# EAGLE design clogic (EAGLE 5.10)

## Sheet 1 of 2
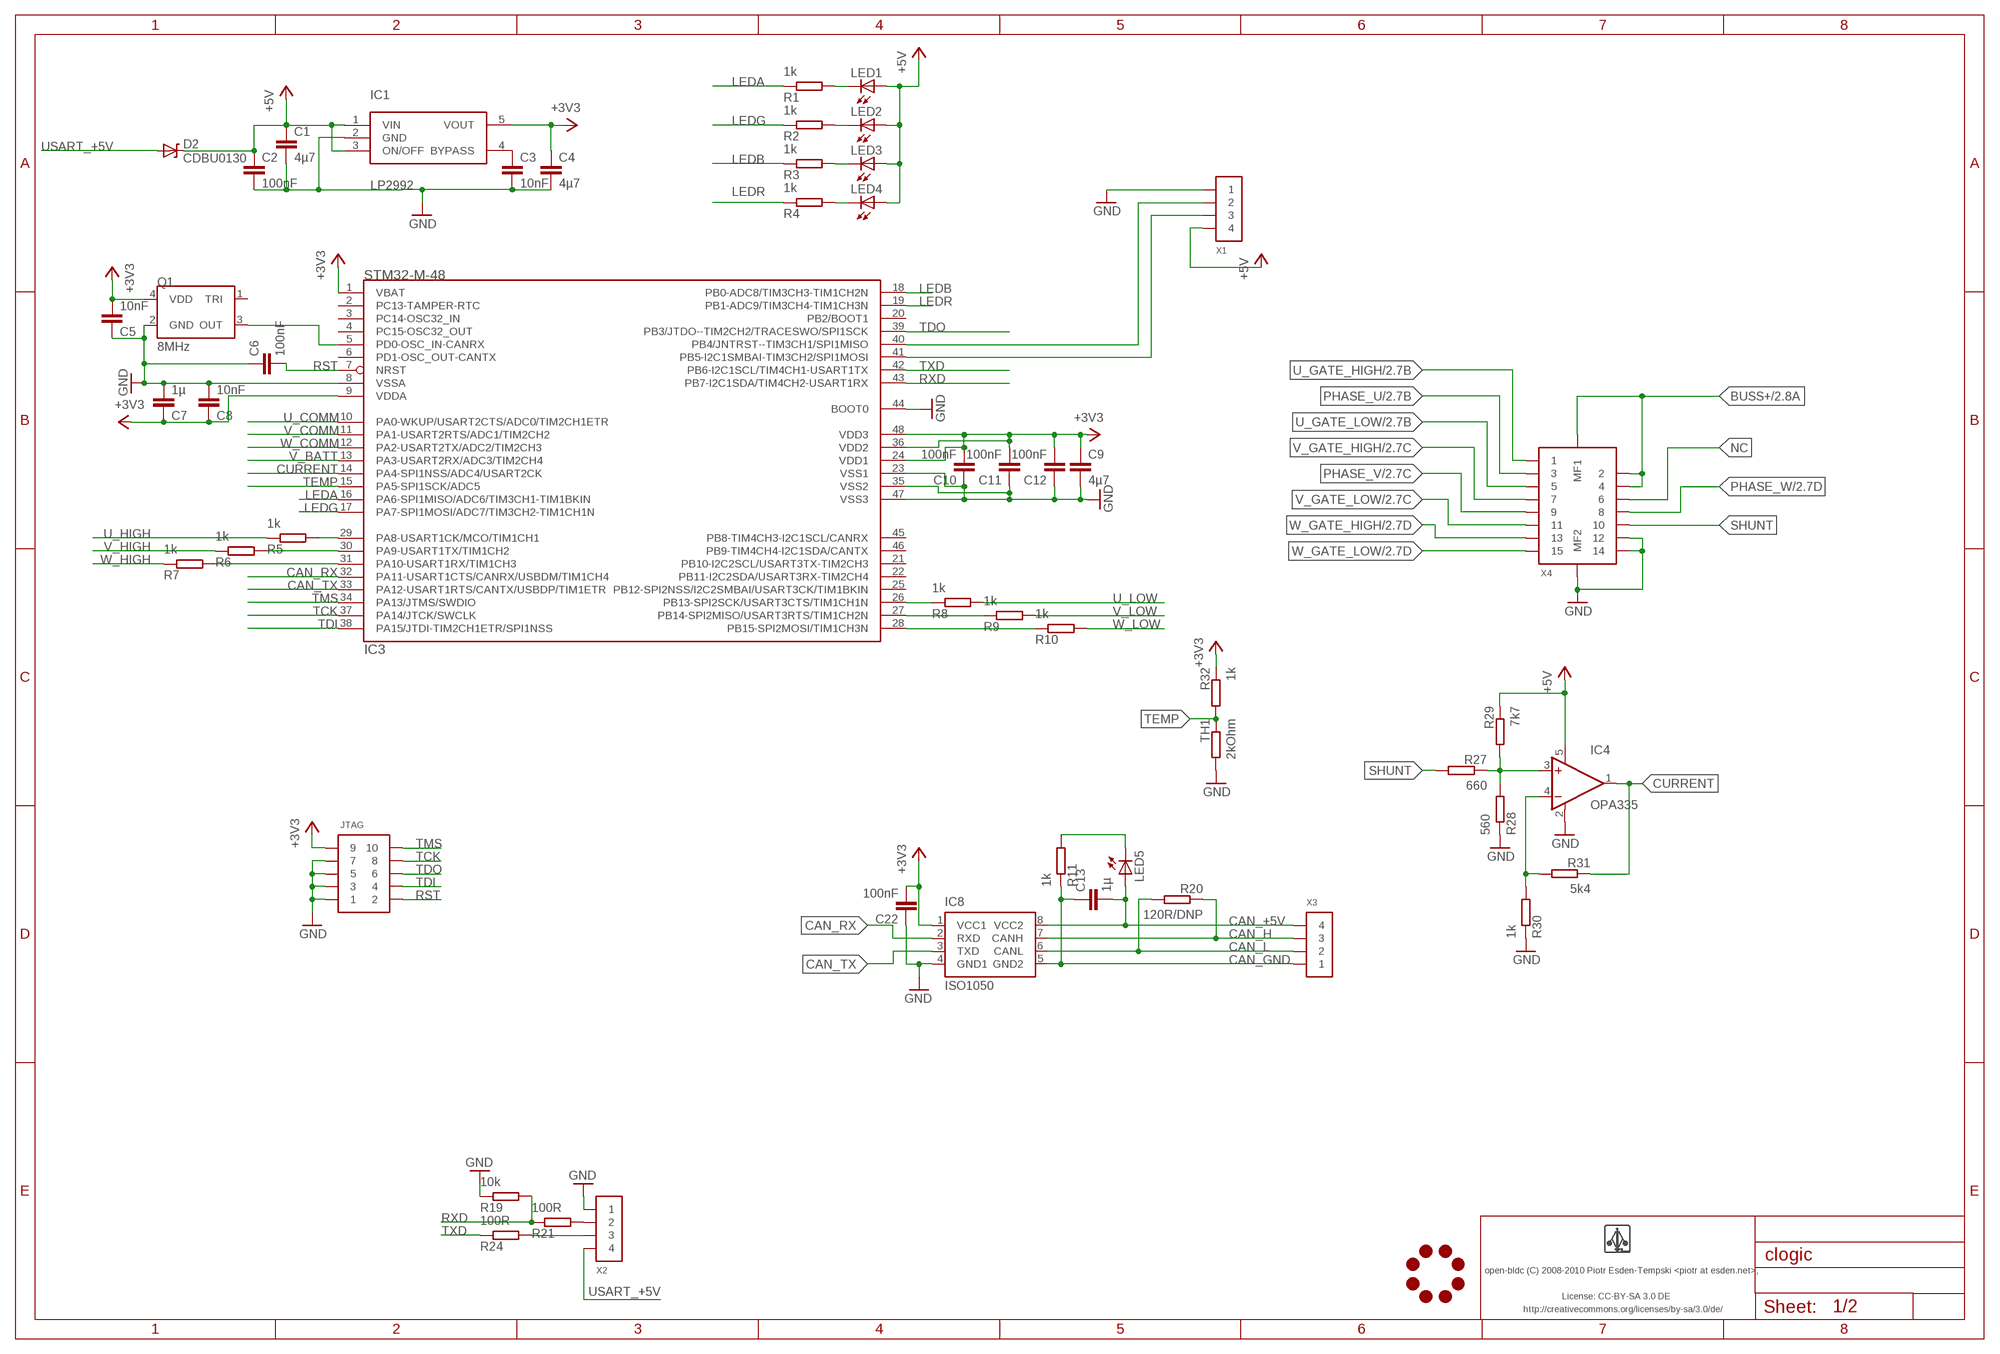
[diagram p0: schematic, sheet 1]

### Parts
C1  4µ7  CAPACITOR-0603  [0603-CAP]
C2  100nF  CAPACITOR-0603  [0603-CAP]
C3  10nF  CAPACITOR-0603  [0603-CAP]
C4  4µ7  CAPACITOR-0603  [0603-CAP]
C5  10nF  CAPACITOR-0603  [0603-CAP]
C6  100nF  CAPACITOR-0603  [0603-CAP]
C7  1µ  CAPACITOR-0603  [0603-CAP]
C8  10nF  CAPACITOR-0603  [0603-CAP]
C9  4µ7  CAPACITOR-0603  [0603-CAP]
C10  100nF  CAPACITOR-0603  [0603-CAP]
C11  100nF  CAPACITOR-0603  [0603-CAP]
C12  100nF  CAPACITOR-0603  [0603-CAP]
C13  1µ  CAPACITOR-0603  [0603-CAP]
C22  100nF  CAPACITOR-0603  [0603-CAP]
D2  CDBU0130  DIODE-ZENER-0603  [0603-LED]
IC1  LP2992  [SOT23-5]
IC3  STM32-M-48  [LQFP48]
IC4  OPA335  [SOT23-5]
IC8  ISO1050  [SO8]
JL1  JOBY_LOGO-6MIL  [JOBY_LOGO_6MIL]
JTAG  CONN_5-2-FTSH-V  [FTSH-105-DV]
LED1  AMBER  LED-0603  [0603-LED]
LED2  GREEN  LED-0603  [0603-LED]
LED3  BLUE  LED-0603  [0603-LED]
LED4  RED  LED-0603  [0603-LED]
LED5  WHITE  LED-0603  [0603-LED]
Q1  8MHz  ASE_ASCILLATOR  [ASE_OSCILLATOR]
R1  1k  RESISTOR-0603  [0603-RES]
R2  1k  RESISTOR-0603  [0603-RES]
R3  1k  RESISTOR-0603  [0603-RES]
R4  1k  RESISTOR-0603  [0603-RES]
R5  1k  RESISTOR-0603  [0603-RES]
R6  1k  RESISTOR-0603  [0603-RES]
R7  1k  RESISTOR-0603  [0603-RES]
R8  1k  RESISTOR-0603  [0603-RES]
R9  1k  RESISTOR-0603  [0603-RES]
R10  1k  RESISTOR-0603  [0603-RES]
R11  1k  RESISTOR-0603  [0603-RES]
R19  10k  RESISTOR-0603  [0603-RES]
R20  120R/DNP  RESISTOR-0603  [0603-RES]
R21  100R  RESISTOR-0603  [0603-RES]
R24  100R  RESISTOR-0603  [0603-RES]
R27  660  RESISTOR-0603  [0603-RES]
R28  560  RESISTOR-0603  [0603-RES]
R29  7k7  RESISTOR-0603  [0603-RES]
R30  1k  RESISTOR-0603  [0603-RES]
R31  5k4  RESISTOR-0603  [0603-RES]
R32  1k  RESISTOR-0603  [0603-RES]
TH1  2kOhm  RESISTOR-0603  [0603-RES]
U$1  LOGO  LOGO-NORM  [LOGO]
X1  CONN_4-1-53261  [PB-53261-04]
X2  CONN_4-1-53261  [PB-53261-04]
X3  CONN_4-1-53261  [PB-53261-04]
X4  CONN_15-2-2MT-DF9  [DF9-15]

### Nets
+3V3: C4.P$1 C5.P$2 C7.P$1 C8.P$1 C9.P$1 C10.P$2 C11.P$2 C12.P$2 C22.P$2 IC1.5(VOUT) IC3.1(VBAT) IC3.9(VDDA) IC3.24(VDD1) IC3.36(VDD2) IC3.48(VDD3) IC8.1(VCC1) JTAG.9 Q1.4(VDD) R32.P$1
+5V: C1.P$1 C2.P$1 D2.C IC1.1(VIN) IC1.3(ON/OFF) IC4.5(V+) LED1.A LED2.A LED3.A LED4.A R29.P$1 X1.4 ; also sheet 2
A: IC3.40(PB4/JNTRST--TIM3CH1/SPI1MISO) X1.2
B: IC3.41(PB5-I2C1SMBAI-TIM3CH2/SPI1MOSI) X1.3
BUSS+: X4.2 X4.4 X4.MF1 ; also sheet 2
CAN_+5V: C13.P$2 IC8.8(VCC2) LED5.A X3.4
CAN_GND: C13.P$1 IC8.5(GND2) R11.P$1 X3.1
CAN_H: IC8.7(CANH) R20.P$1 X3.3
CAN_L: IC8.6(CANL) R20.P$2 X3.2
CAN_RX: IC3.32(PA11-USART1CTS/CANRX/USBDM/TIM1CH4) IC8.2(RXD)
CAN_TX: IC3.33(PA12-USART1RTS/CANTX/USBDP/TIM1ETR) IC8.3(TXD)
CURRENT: IC3.14(PA4-SPI1NSS/ADC4/USART2CK) IC4.1(OUT) R31.P$1
GND: C1.P$2 C2.P$2 C3.P$2 C4.P$2 C5.P$1 C6.P$1 C7.P$2 C8.P$2 C9.P$2 C10.P$1 C11.P$1 C12.P$1 C22.P$1 IC1.2(GND) IC3.8(VSSA) IC3.23(VSS1) IC3.35(VSS2) IC3.44(BOOT0) IC3.47(VSS3) IC4.2(V-) IC8.4(GND1) JTAG.1 JTAG.3 JTAG.5 JTAG.7 Q1.2(GND) R19.P$1 R28.P$1 R30.P$1 TH1.P$2 X1.1 X2.1 X4.12 X4.14 X4.MF2 ; also sheet 2
LEDA: IC3.16(PA6-SPI1MISO/ADC6/TIM3CH1-TIM1BKIN) R1.P$1
LEDB: IC3.18(PB0-ADC8/TIM3CH3-TIM1CH2N) R3.P$1
LEDG: IC3.17(PA7-SPI1MOSI/ADC7/TIM3CH2-TIM1CH1N) R2.P$1
LEDR: IC3.19(PB1-ADC9/TIM3CH4-TIM1CH3N) R4.P$1
N$1: LED5.C R11.P$2
N$3: LED1.C R1.P$2
N$4: LED4.C R4.P$2
N$5: LED3.C R3.P$2
N$6: R21.P$2 X2.2
N$10: LED2.C R2.P$2
N$11: IC4.3(+IN) R27.P$1 R28.P$2 R29.P$2
N$12: IC4.4(-IN) R30.P$2 R31.P$2
N$20: R24.P$2 X2.3
N$22: C3.P$1 IC1.4(BYPASS)
N$33: IC3.26(PB13-SPI2SCK/USART3CTS/TIM1CH1N) R8.P$1
N$36: IC3.27(PB14-SPI2MISO/USART3RTS/TIM1CH2N) R9.P$1
N$39: IC3.28(PB15-SPI2MOSI/TIM1CH3N) R10.P$1
N$40: IC3.5(PD0-OSC_IN-CANRX) Q1.3(OUT)
N$41: IC3.29(PA8-USART1CK/MCO/TIM1CH1) R5.P$2
N$42: IC3.30(PA9-USART1TX/TIM1CH2) R6.P$2
N$45: IC3.31(PA10-USART1RX/TIM1CH3) R7.P$2
NC: X4.6
PHASE_U: X4.3 ; also sheet 2
PHASE_V: X4.9 ; also sheet 2
PHASE_W: X4.8 ; also sheet 2
RST: C6.P$2 IC3.7(NRST) JTAG.2
RXD: IC3.43(PB7-I2C1SDA/TIM4CH2-USART1RX) R19.P$2 R21.P$1
SHUNT: R27.P$2 X4.10
TCK: IC3.37(PA14/JTCK/SWCLK) JTAG.8
TDI: IC3.38(PA15/JTDI-TIM2CH1ETR/SPI1NSS) JTAG.4
TDO: IC3.39(PB3/JTDO--TIM2CH2/TRACESWO/SPI1SCK) JTAG.6
TEMP: IC3.15(PA5-SPI1SCK/ADC5) R32.P$2 TH1.P$1
TMS: IC3.34(PA13/JTMS/SWDIO) JTAG.10
TXD: IC3.42(PB6-I2C1SCL/TIM4CH1-USART1TX) R24.P$1
U_COMM: IC3.10(PA0-WKUP/USART2CTS/ADC0/TIM2CH1ETR) ; also sheet 2
U_GATE_HIGH: X4.1 ; also sheet 2
U_GATE_LOW: X4.5 ; also sheet 2
U_HIGH: R5.P$1 ; also sheet 2
U_LOW: R8.P$2 ; also sheet 2
USART_+5V: D2.A X2.4
V_BATT: IC3.13(PA3-USART2RX/ADC3/TIM2CH4) ; also sheet 2
V_COMM: IC3.11(PA1-USART2RTS/ADC1/TIM2CH2) ; also sheet 2
V_GATE_HIGH: X4.7 ; also sheet 2
V_GATE_LOW: X4.11 ; also sheet 2
V_HIGH: R6.P$1 ; also sheet 2
V_LOW: R9.P$2 ; also sheet 2
W_COMM: IC3.12(PA2-USART2TX/ADC2/TIM2CH3) ; also sheet 2
W_GATE_HIGH: X4.13 ; also sheet 2
W_GATE_LOW: X4.15 ; also sheet 2
W_HIGH: R7.P$1 ; also sheet 2
W_LOW: R10.P$2 ; also sheet 2
Unconnected: IC3.2(PC13-TAMPER-RTC) IC3.3(PC14-OSC32_IN) IC3.4(PC15-OSC32_OUT) IC3.6(PD1-OSC_OUT-CANTX) IC3.20(PB2/BOOT1) IC3.21(PB10-I2C2SCL/USART3TX-TIM2CH3) IC3.22(PB11-I2C2SDA/USART3RX-TIM2CH4) IC3.25(PB12-SPI2NSS/I2C2SMBAI/USART3CK/TIM1BKIN) IC3.45(PB8-TIM4CH3-I2C1SCL/CANRX) IC3.46(PB9-TIM4CH4-I2C1SDA/CANTX) Q1.1(TRI)

### Notes on the sheet
- open-bldc (C) 2008-2010 Piotr Esden-Tempski <piotr at esden.net>,
- License: CC-BY-SA 3.0 DE
- http://creativecommons.org/licenses/by-sa/3.0/de/

## Sheet 2 of 2
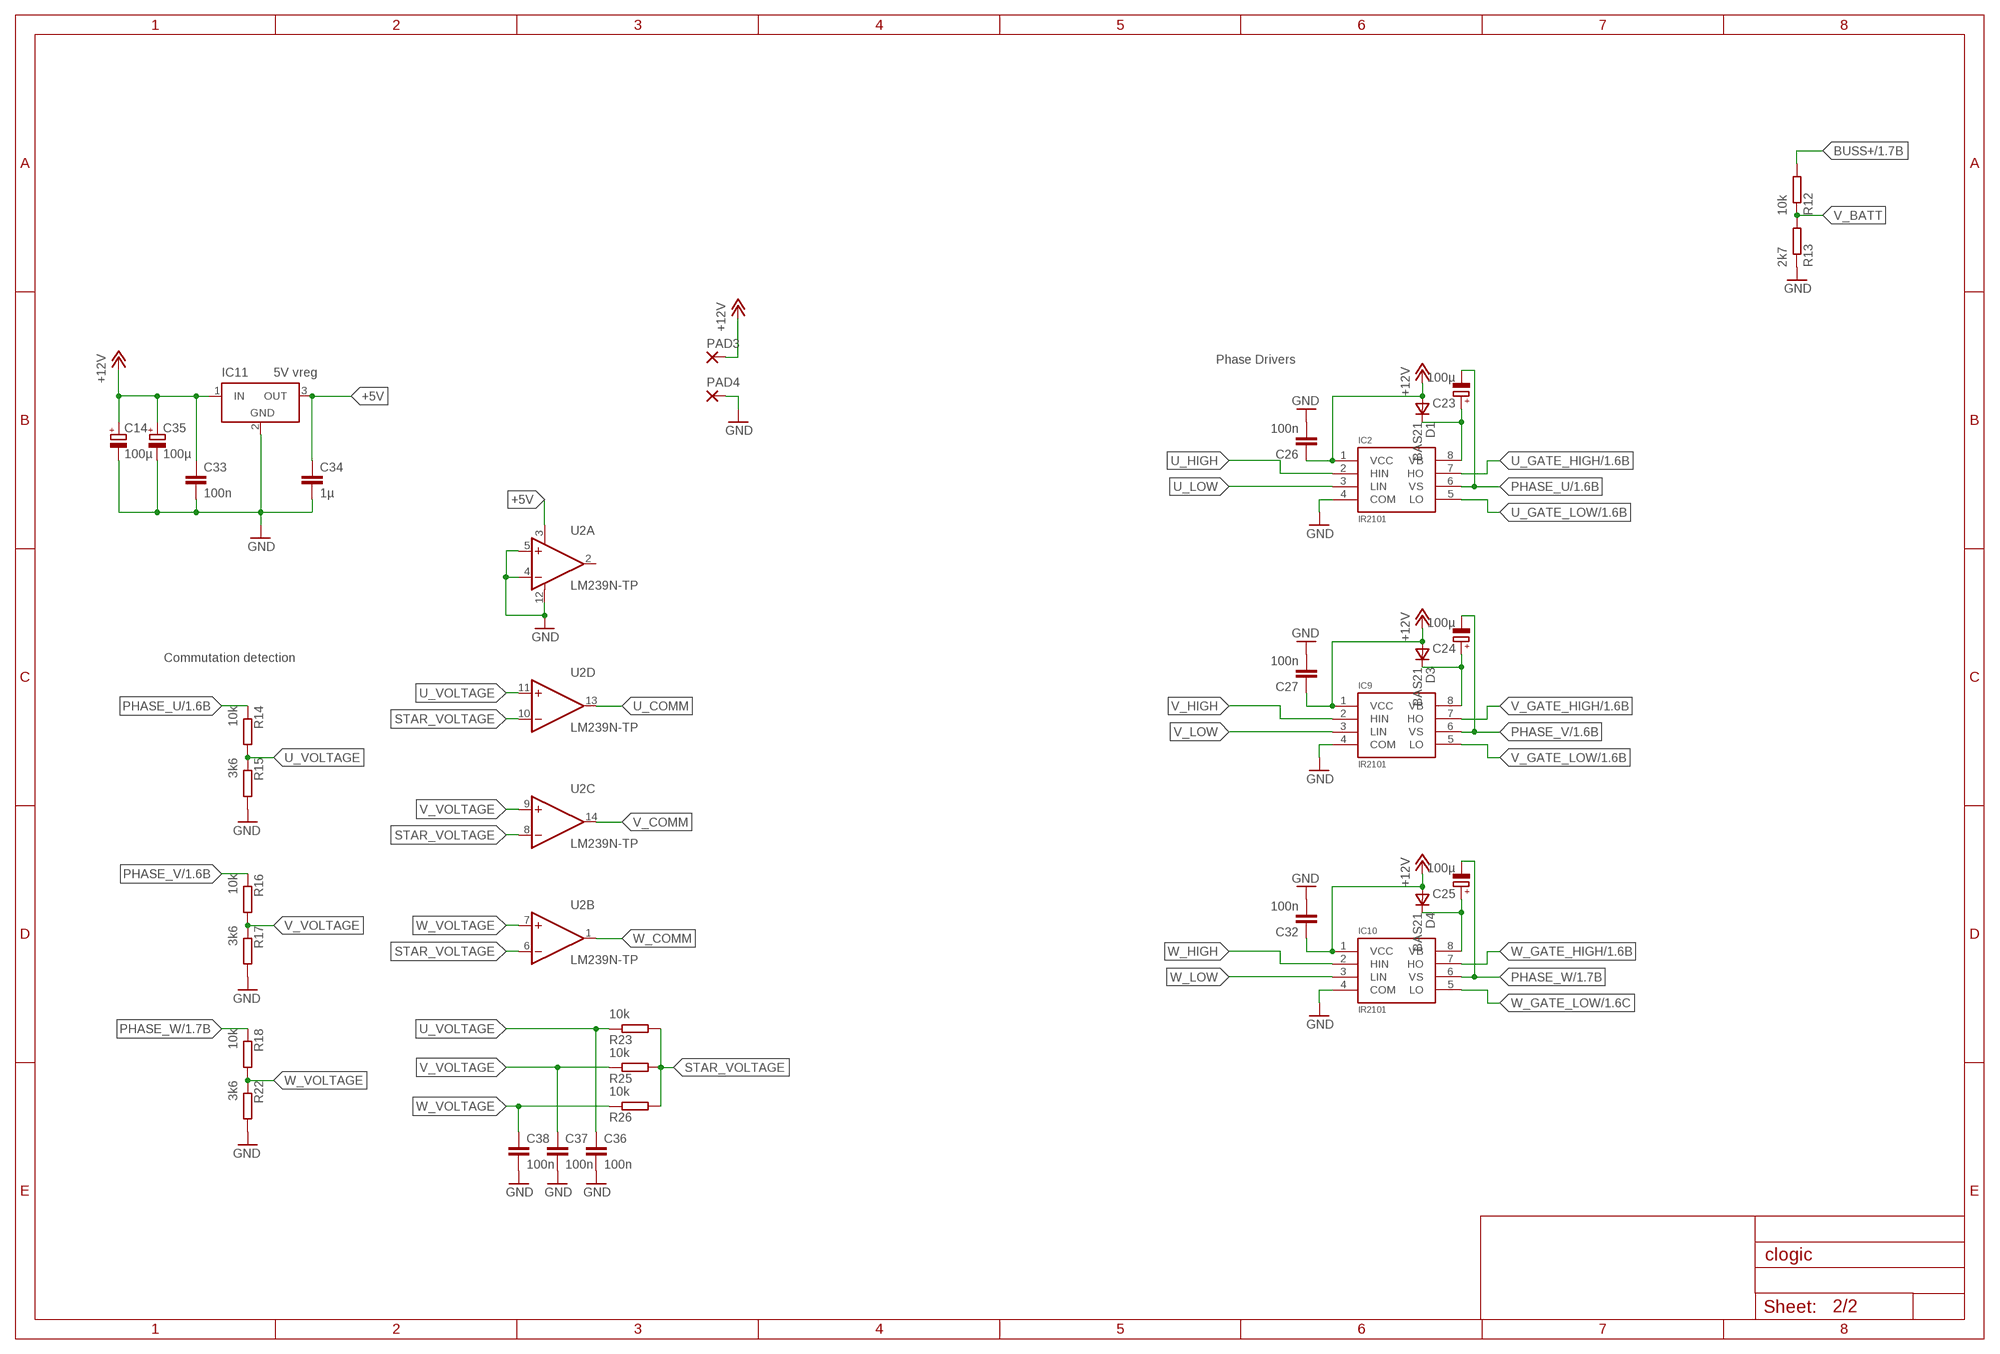
[diagram p1: schematic, sheet 2]

### Parts
C14  100µ  CAPACITOR-POLA  [3216/A]
C23  100µ  CAPACITOR-POL-0805  [0805-POL-CAP]
C24  100µ  CAPACITOR-POL-0805  [0805-POL-CAP]
C25  100µ  CAPACITOR-POL-0805  [0805-POL-CAP]
C26  100n  CAPACITOR-0603  [0603-CAP]
C27  100n  CAPACITOR-0603  [0603-CAP]
C32  100n  CAPACITOR-0603  [0603-CAP]
C33  100n  CAPACITOR-0603  [0603-CAP]
C34  1µ  CAPACITOR-0603  [0603-CAP]
C35  100µ  CAPACITOR-POLA  [3216/A]
C36  100n  CAPACITOR-0603  [0603-CAP]
C37  100n  CAPACITOR-0603  [0603-CAP]
C38  100n  CAPACITOR-0603  [0603-CAP]
D1  BAS21  VAR2SOT23  [SOT-23]
D3  BAS21  VAR2SOT23  [SOT-23]
D4  BAS21  VAR2SOT23  [SOT-23]
IC2  IR2101  [SO-8]
IC9  IR2101  [SO-8]
IC10  IR2101  [SO-8]
IC11  5V vreg  LT1129CST5  [SOT223]
PAD3  SMD5  [SMD2,54-5,08]
PAD4  SMD5  [SMD2,54-5,08]
R12  10k  RESISTOR-0603  [0603-RES]
R13  2k7  RESISTOR-0603  [0603-RES]
R14  10k  RESISTOR-0603  [0603-RES]
R15  3k6  RESISTOR-0603  [0603-RES]
R16  10k  RESISTOR-0603  [0603-RES]
R17  3k6  RESISTOR-0603  [0603-RES]
R18  10k  RESISTOR-0603  [0603-RES]
R22  3k6  RESISTOR-0603  [0603-RES]
R23  10k  RESISTOR-0603  [0603-RES]
R25  10k  RESISTOR-0603  [0603-RES]
R26  10k  RESISTOR-0603  [0603-RES]
U2  LM239N-TP  [TSSOP_14]

### Nets
+5V: C34.P$1 IC11.3(OUT) U2.3(A:V+) ; also sheet 1
+12V: C14.+ C26.P$1 C27.P$1 C32.P$1 C33.P$1 C35.+ D1.3(A) D3.3(A) D4.3(A) IC2.1(VCC) IC9.1(VCC) IC10.1(VCC) IC11.1(IN) PAD3.1(P)
BUSS+: R12.P$2 ; also sheet 1
GND: C14.- C26.P$2 C27.P$2 C32.P$2 C33.P$2 C34.P$2 C35.- C36.P$2 C37.P$2 C38.P$2 IC2.4(COM) IC9.4(COM) IC10.4(COM) IC11.2(GND) PAD4.1(P) R13.P$1 R15.P$2 R17.P$2 R22.P$2 U2.4(A:-IN) U2.5(A:+IN) U2.12(A:V-) ; also sheet 1
N$2: C23.+ D1.1(C) IC2.8(VB)
N$7: C24.+ D3.1(C) IC9.8(VB)
N$8: C25.+ D4.1(C) IC10.8(VB)
PHASE_U: C23.- IC2.6(VS) R14.P$1 ; also sheet 1
PHASE_V: C24.- IC9.6(VS) R16.P$1 ; also sheet 1
PHASE_W: C25.- IC10.6(VS) R18.P$1 ; also sheet 1
STAR_VOLTAGE: R23.P$2 R25.P$2 R26.P$2 U2.6(B:-IN) U2.8(C:-IN) U2.10(D:-IN)
U_COMM: U2.13(D:OUT) ; also sheet 1
U_GATE_HIGH: IC2.7(HO) ; also sheet 1
U_GATE_LOW: IC2.5(LO) ; also sheet 1
U_HIGH: IC2.2(HIN) ; also sheet 1
U_LOW: IC2.3(LIN) ; also sheet 1
U_VOLTAGE: C36.P$1 R14.P$2 R15.P$1 R23.P$1 U2.11(D:+IN)
V_BATT: R12.P$1 R13.P$2 ; also sheet 1
V_COMM: U2.14(C:OUT) ; also sheet 1
V_GATE_HIGH: IC9.7(HO) ; also sheet 1
V_GATE_LOW: IC9.5(LO) ; also sheet 1
V_HIGH: IC9.2(HIN) ; also sheet 1
V_LOW: IC9.3(LIN) ; also sheet 1
V_VOLTAGE: C37.P$1 R16.P$2 R17.P$1 R25.P$1 U2.9(C:+IN)
W_COMM: U2.1(B:OUT) ; also sheet 1
W_GATE_HIGH: IC10.7(HO) ; also sheet 1
W_GATE_LOW: IC10.5(LO) ; also sheet 1
W_HIGH: IC10.2(HIN) ; also sheet 1
W_LOW: IC10.3(LIN) ; also sheet 1
W_VOLTAGE: C38.P$1 R18.P$2 R22.P$1 R26.P$1 U2.7(B:+IN)
Unconnected: U2.2(A:OUT)

### Notes on the sheet
- Phase Drivers
- Commutation detection

## Power pins joined to a net without a drawn wire
GND: IC11.4(GND)

## Library data of the parts
C1-C13 C22 C26 C27 C32-C34 C36-C38 = pel_dipol_comp:CAPACITOR
C14 C23-C25 C35 = pel_dipol_comp:CAPACITOR-POL
D1 D3 D4 = zetex:VAR2SOT23: DIODE
D2 = pel_dipol_comp:DIODE-ZENER
IC1 = open-bldc:LP2992
IC2 IC9 IC10 = open-bldc:IR2101
IC3 = pel_stm32:STM32-M-48: STM32F103 Medium Density 48pins
IC4 = open-bldc:OPA335
IC8 = open-bldc:ISO1050
IC11 = linear-technology:LT1129CST5: VOLTAGE REGULATOR with shutdown
JL1 = open-bldc:JOBY_LOGO
JTAG = pel_misc:CONN_5-2
LED1-LED5 = pel_dipol_comp:LED
PAD3 PAD4 = wirepad:SMD5: SMD PAD
Q1 = open-bldc:ASE_ASCILLATOR
R1-R32 TH1 = pel_dipol_comp:RESISTOR
U2 = open-bldc:LM239N
U$1 = open-bldc:LOGO
X1-X3 = pel_molex:CONN_4-1
X4 = open-bldc:CONN_15-2-2MT

## Board
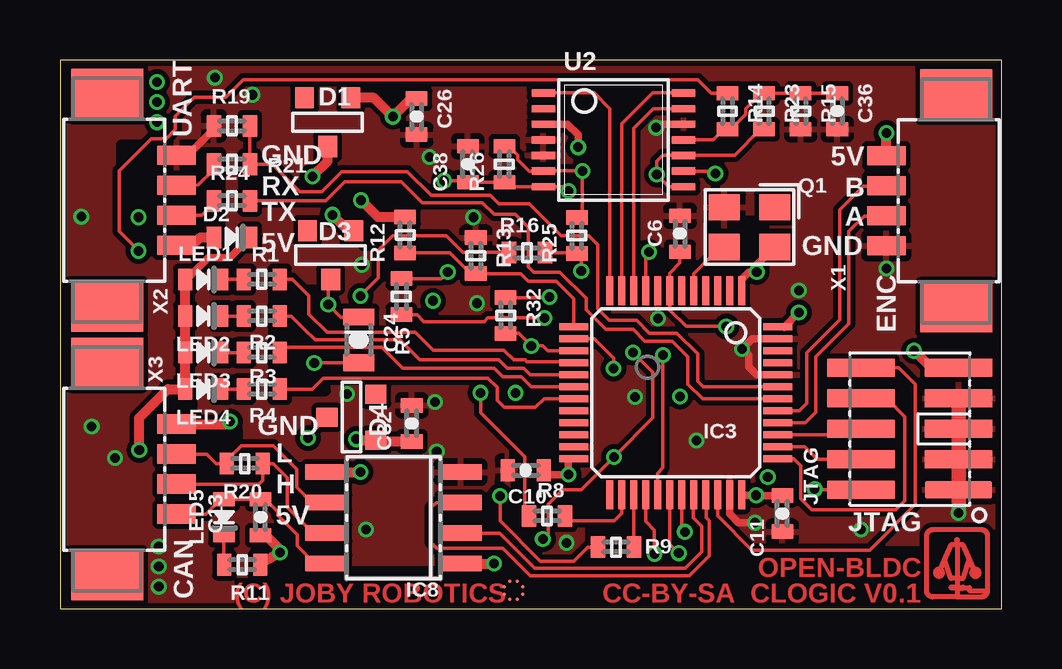
[diagram p2: board, top side]
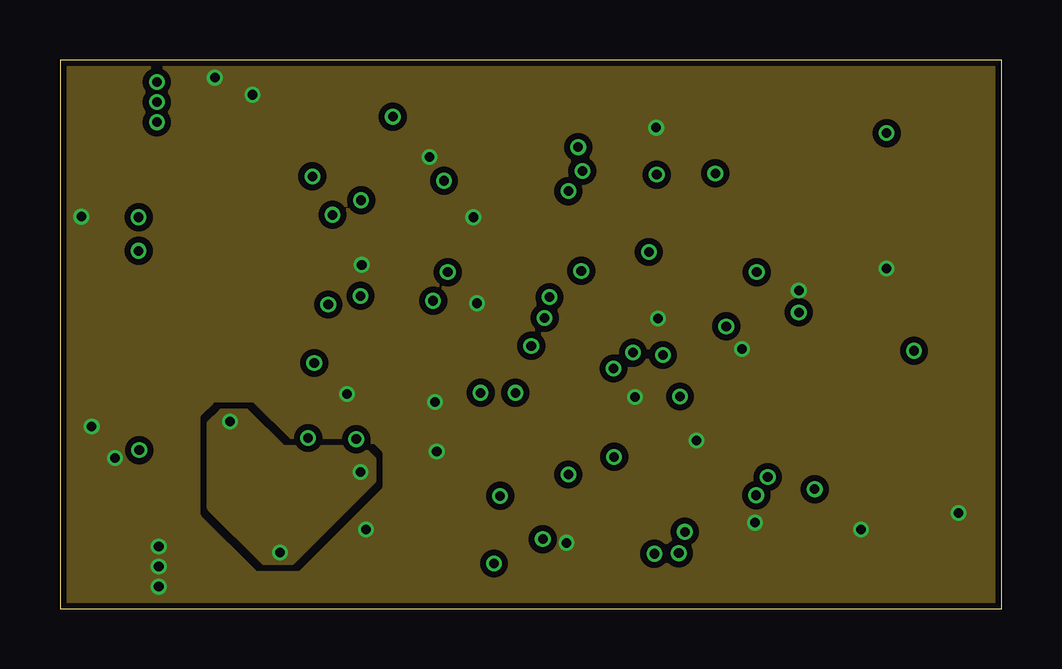
[diagram p3: board, inner layer Route2]
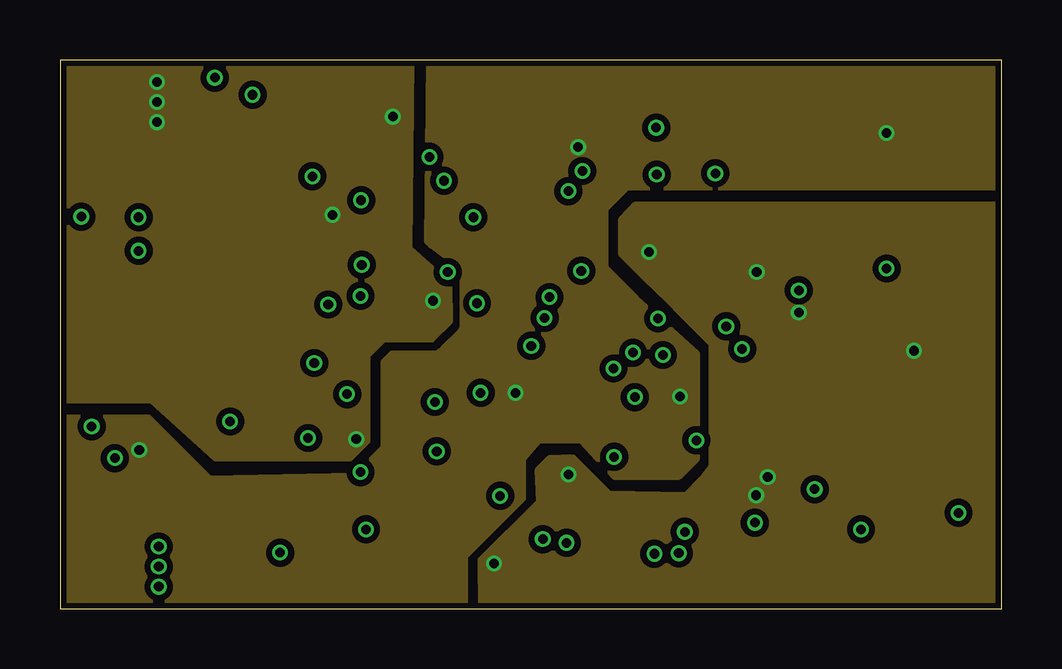
[diagram p4: board, inner layer Route15]
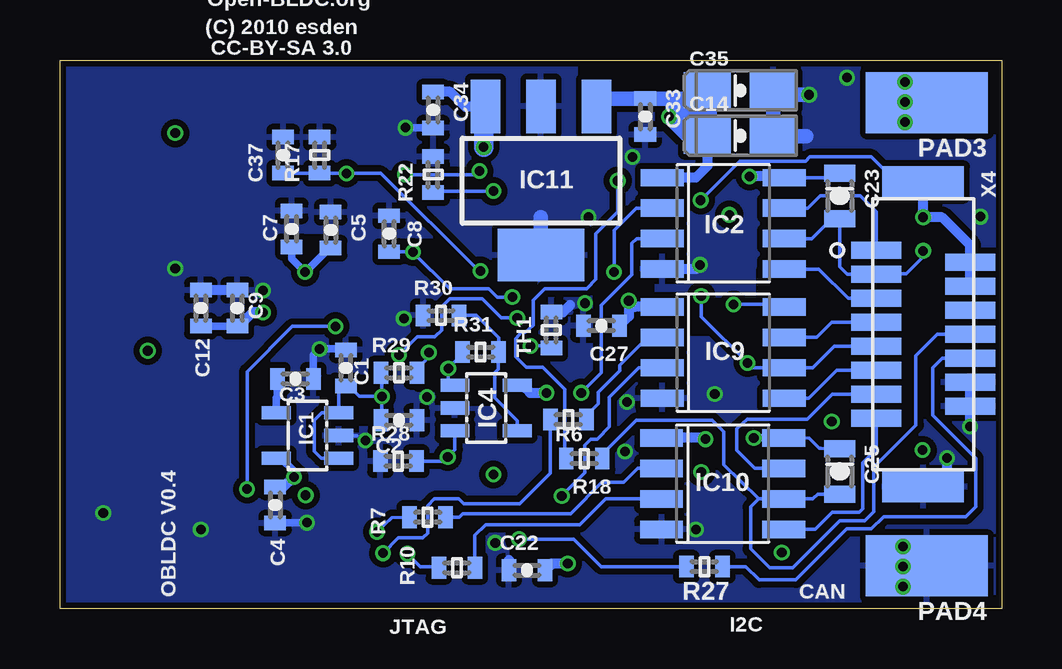
[diagram p5: board, bottom side, seen from below]

Size 39.24 x 22.86 mm. Coordinates in mm from the lower left corner, seen from the top.
Outline: 0,0 39.24,0 39.24,22.86 0,22.86 0,0
Copper layers (1*2+15*16): Top 0.035mm / dielectric 0.75mm / Route2 0.035mm / dielectric 0.15mm / Route15 0.035mm / dielectric 0.75mm / Bottom 0.035mm
Design rules "default *": minimum track width 6mil, minimum drill 15mil, track to track 6mil, track to pad 6mil, pad to pad 6mil, via to via 6mil, smd to smd 6mil, copper to edge 10mil, drill to drill 8mil, minimum pad ring 5mil, minimum via ring 5mil, stop-mask expansion 4mil, vias tented up to drill 0.4mm, thermal gap 10mil
tRestrict: area 2.5,16.3 to 4.2,19.3; area 4,7.8 to 5.5,9; area 5.6,6.4 to 7.4,7.4; area 10.2,2 to 12,5.8; area 8.9,9.1 to 11.1,13.3; area 24.5,13.8 to 25.8,14.8; area 28.3,14.1 to 29.4,16.2; area 26.5,19.7 to 28.9,21.7; area 7.6,17 to 8.9,18.4; area 12.6,15.1 to 14.3,16.2; area 18.9,6.3 to 20.8,8.8; area 11.2,0.3 to 16.7,1.5; 3 more areas
bRestrict: area 6.4,11.6 to 10,14.1; area 18.1,2 to 20.2,2.7; area 21.8,1.8 to 24.3,3.9; area 20.8,8.7 to 22.7,12; area 28.2,14.7 to 29.3,15.4; area 23.3,9.3 to 24.3,10.3; area 9.8,11.6 to 13.4,12.7; area 26.1,7.8 to 28.2,9.5; area 23,14.7 to 25.1,15.2; area 10.5,18.9 to 11.4,22.3; area 14.7,12.7 to 16.8,13.8; area 13.2,21.3 to 17.4,22.6

### Footprints (pad centres in the part's own frame; a part is rotated, then mirrored left to right if it is on the bottom)
0603-CAP = smd 0.6 x 0.9: P$1 -0.75,0; P$2 0.75,0
3216/A = smd 1.95 x 1.5: + -1.375,0; - 1.375,0
0805-POL-CAP = smd 0.7 x 1.3: + -0.95,0; - 0.95,0
SOT-23 = smd 0.787 x 0.889: 1 0.025,-1.016; 2 -0.94,1.016; 3 0.991,1.016
0603-LED = smd 0.6 x 0.9: A 0.75,0; C -0.75,0
SOT23-5 = smd 0.55 x 1.2: 1 -0.95,-1.3; 2 0,-1.3; 3 0.95,-1.3; 4 0.95,1.3; 5 -0.95,1.3
SO-8 = smd 0.72 x 1.78: 1 -1.905,-2.543; 2 -0.635,-2.543; 3 0.635,-2.543; 4 1.905,-2.543; 5 1.905,2.543; 6 0.635,2.543; 7 -0.635,2.543; 8 -1.905,2.543
LQFP48 = smd 0.3 x 1.2: 1 -2.75,-4.25; 2 -2.25,-4.25; 3 -1.75,-4.25; 4 -1.25,-4.25; 5 -0.75,-4.25; 6 -0.25,-4.25; 7 0.25,-4.25; 8 0.75,-4.25; 9 1.25,-4.25; 10 1.75,-4.25; 11 2.25,-4.25; 12 2.75,-4.25; 25 2.75,4.25; 26 2.25,4.25; 27 1.75,4.25; 28 1.25,4.25; 29 0.75,4.25; 30 0.25,4.25; 31 -0.25,4.25; 32 -0.75,4.25; 33 -1.25,4.25; 34 -1.75,4.25; 35 -2.25,4.25; 36 -2.75,4.25 | smd 1.2 x 0.3: 13 4.25,-2.75; 14 4.25,-2.25; 15 4.25,-1.75; 16 4.25,-1.25; 17 4.25,-0.75; 18 4.25,-0.25; 19 4.25,0.25; 20 4.25,0.75; 21 4.25,1.25; 22 4.25,1.75; 23 4.25,2.25; 24 4.25,2.75; 37 -4.25,2.75; 38 -4.25,2.25; 39 -4.25,1.75; 40 -4.25,1.25; 41 -4.25,0.75; 42 -4.25,0.25; 43 -4.25,-0.25; 44 -4.25,-0.75; 45 -4.25,-1.25; 46 -4.25,-1.75; 47 -4.25,-2.25; 48 -4.25,-2.75
SO8 = smd 0.65 x 1.75: 1 -1.905,-2.8; 2 -0.635,-2.8; 3 0.635,-2.8; 4 1.905,-2.8; 5 1.905,2.8; 6 0.635,2.8; 7 -0.635,2.8; 8 -1.905,2.8
SOT223 = smd 1.219 x 2.235: 1 -2.311,-3.099; 2 0,-3.099; 3 2.311,-3.099 | smd 3.6 x 2.2: 4 0,3.099
JOBY_LOGO_6MIL = smd 0.152 x 0.152: 1 -0.152,0.381; 2 0.152,0.381; 3 0.381,0.152; 4 0.381,-0.152; 5 0.152,-0.381; 6 -0.152,-0.381; 7 -0.381,-0.152; 8 -0.381,0.152
FTSH-105-DV = smd 0.74 x 2.8: 1 -2.54,-2.03; 2 -2.54,2.03; 3 -1.27,-2.03; 4 -1.27,2.03; 5 0,-2.03; 6 0,2.03; 7 1.27,-2.03; 8 1.27,2.03; 9 2.54,-2.03; 10 2.54,2.03
SMD2,54-5,08 = smd 2.54 x 5.08: 1 0,0
ASE_OSCILLATOR = smd 1.3 x 1.1: 1 -1.05,-0.825; 2 1.05,-0.825; 3 1.05,0.825; 4 -1.05,0.825
0603-RES = smd 0.6 x 0.9: P$1 -0.75,0; P$2 0.75,0
TSSOP_14 = smd 0.305 x 0.991: 1 -1.95,-2.918; 2 -1.3,-2.918; 3 -0.65,-2.918; 4 0,-2.918; 5 0.65,-2.918; 6 1.3,-2.918; 7 1.95,-2.918; 8 1.95,2.918; 9 1.3,2.918; 10 0.65,2.918; 11 0,2.918; 12 -0.65,2.918; 13 -1.3,2.918; 14 -1.95,2.918
PB-53261-04 = smd 0.8 x 1.6: 1 -1.875,1.1; 2 -0.625,1.1; 3 0.625,1.1; 4 1.875,1.1 | smd 2.1 x 3: MNT1 -4.425,-1.8; MNT2 4.425,-1.8
DF9-15 = smd 0.7 x 2.08: 1 -3.5,-1.96; 2 -3,1.96; 3 -2.5,-1.96; 4 -2,1.96; 5 -1.5,-1.96; 6 -1,1.96; 7 -0.5,-1.96; 8 0,1.96; 9 0.5,-1.96; 10 1,1.96; 11 1.5,-1.96; 12 2,1.96; 13 2.5,-1.96; 14 3,1.96; 15 3.5,-1.96 | smd 1.3 x 3.4: MF1 -6.35,0; MF2 6.35,0

### Placement (x,y rotation side)
C1  27.33,10.03 90 bottom
C2  25.12,7.85 0 bottom
C3  29.44,9.58 0 bottom
C4  30.28,4.32 270 bottom
C5  27.97,15.77 270 bottom
C6  25.83,15.62 270 top
C7  29.59,15.82 90 bottom
C8  25.53,15.62 90 bottom
C9  31.85,12.52 90 bottom
C10  19.41,5.77 0 top
C11  30.1,3.96 90 top
C12  33.38,12.52 270 bottom
C13  8.36,3.81 90 top
C14  10.9,19.71 0 bottom
C22  19.79,1.6 0 bottom
C23  6.76,17.2 270 bottom
C24  12.45,11.2 270 top
C25  6.76,5.71 270 bottom
C26  14.86,20.5 270 top
C27  16.69,11.79 180 bottom
C32  14.66,7.72 90 top
C33  14.86,20.5 270 bottom
C34  23.7,20.78 270 bottom
C35  10.9,21.59 0 bottom
C36  32.38,20.73 270 top
C37  29.95,18.9 90 bottom
C38  16.99,18.52 90 top
D1  11.13,20.27 0 top
D2  7.16,15.47 180 top
D3  11.25,14.73 0 top
D4  12.14,8 270 top
IC1  28.93,7.21 90 bottom
IC2  11.61,16.05 270 bottom
IC3  25.65,8.99 180 top
IC4  21.49,8.36 270 bottom
IC8  13.89,3.78 90 top
IC9  11.61,10.67 270 bottom
IC10  11.63,5.21 270 bottom
IC11  19.2,17.83 180 bottom
JL1  18.9,0.76 0 top
JTAG  35.41,7.49 90 top
LED1  5.97,13.72 180 top
LED2  5.97,12.19 180 top
LED3  5.97,10.67 180 top
LED4  5.97,9.14 180 top
LED5  6.83,3.81 90 top
PAD3  3.12,21.08 90 bottom
PAD4  3.12,1.78 90 bottom
Q1  28.73,15.9 180 top
R1  8.41,13.72 180 top
R2  8.41,12.19 180 top
R3  8.41,10.67 180 top
R4  8.41,9.14 180 top
R5  14.22,13 270 top
R6  18.06,7.87 180 bottom
R7  23.93,3.81 180 bottom
R8  20.29,3.86 180 top
R9  23.16,2.57 180 top
R10  22.71,1.7 0 bottom
R11  7.59,1.83 180 top
R12  14.38,15.57 90 top
R13  17.32,14.71 270 top
R14  27.81,20.73 270 top
R15  30.86,20.73 270 top
R16  19.46,14.83 0 top
R17  28.42,18.9 90 bottom
R18  17.4,6.25 180 bottom
R19  7.16,20.12 0 top
R20  7.7,6.05 180 top
R21  7.16,18.52 180 top
R22  23.7,18.08 90 bottom
R23  29.34,20.73 270 top
R24  7.16,16.99 180 top
R25  21.54,15.54 90 top
R26  18.52,18.52 90 top
R27  12.4,1.75 0 bottom
R28  25.15,6.15 0 bottom
R29  25.12,9.83 0 bottom
R30  23.37,12.22 0 bottom
R31  21.72,10.69 0 bottom
R32  18.57,12.22 270 top
TH1  18.77,11.61 90 bottom
U2  23.06,19.53 270 top
U$1  37.36,1.78 0 top
X1  35.53,16.99 90 top
X2  3.76,17.02 270 top
X3  3.76,5.82 270 top
X4  3.28,11.43 270 bottom

### Tracks (layer width: path | path; a pad name or v marks a point on that pad's centre or on a via)
+3V3  (via drill 0.4 pad 0.65)
  Top 0.152: IC3.9 24.4,14.73 v24.54,14.86 | R32.P$1 18.58,12.95 20.24,12.95 20.27,12.98 v20.4,12.98
  Top 0.305: C10.P$2 20.14,5.77 20.32,5.59 v21.18,5.59 21.18,6.25 IC3.24 | C11.P$2 29.12,4.71 v29.01,4.72 28.42,4.72 IC3.36 | IC3.1 28.4,13.72 28.7,14.02 v29.03,14.02 29.04,14.33 Q1.4 | IC3.48 30.18,11.73 v30.79,12.34
  Top 0.406: IC8.1 v18.09,1.88 | JTAG.9 36.3,10.03 v35.59,10.74 | Q1.4 29.78,14.99
  Bottom 0.152: 25.52,14.86 C8.P$1 24.55,14.87 v24.54,14.86 23.01,13.34 21.39,13.34 21.03,12.98 v20.4,12.98
  Bottom 0.305: 31.81,11.73 C9.P$1 C12.P$2 | IC1.5 30.04,6.26 29.49,5.71 v29.49,5.49 | C5.P$2 27.96,14.94 28.12,14.94 v29.03,14.02 29.59,14.58 C7.P$1
  Bottom 0.406: C5.P$2 | 31.81,11.73 31.2,12.34 v30.79,12.34 | C22.P$2 18.76,1.88 v18.09,1.88 | C4.P$1 29.93,5.07 v29.49,5.49
  pour Route15 (isolate 0.254, rank 6): 17.53,0 17.5,2.03 19.94,4.45 19.89,5.79 20.4,6.3 21.34,6.35 22.86,4.83 26.09,4.78 26.72,5.41 27.13,5.94 27.13,11.02 25.63,12.52 24.59,13.54 23.37,14.76 23.37,16.23 23.75,16.61 23.98,16.87 39.24,16.89 39.24,0
+5V  (via drill 0.4 pad 0.65)
  Top 0.305: 5.28,13.72 LED1.A 5.33,13.72 5.33,13.79 6.17,14.63 7.08,14.63 D2.C | U2.3 21.14,20.18 21.59,19.74 v21.59,19.23
  Top 0.406: LED1.A LED2.A LED3.A LED4.A 4.5,9.14 3.3,7.95 v3.3,6.6 | X1.4 v34.44,19.8 v34.44,19.81
  Bottom 0.152: IC1.1 28.36,6.26 28.65,6.55 28.65,7.85 28.35,8.15 IC1.3 27.63,8.98 C1.P$1 27.21,9.28 26.77,8.84 v25.83,8.84 | IC4.5 19.98,9.31 | R29.P$1 25.83,9.79 v25.83,8.84 | C2.P$1 25.83,7.89 v25.83,8.84
  Bottom 0.406: C34.P$1 22.98,21.53 22.35,20.9 21.54,20.9 | 21.54,20.9 IC11.3 | 19.98,9.31 19.66,8.99 v18.97,8.99 | 21.59,20.85 21.54,20.9
  Bottom 0.813: v21.59,19.23 21.59,20.85
  pour Route15 (isolate 0.254, rank 6): 16.89,0 0,0 0,8 3.68,8 6.22,5.46 12.32,5.59 13.46,6.73 13.46,10.29 13.84,10.67 15.75,10.67 16.76,11.68 16.76,14.1 16.13,14.61 15.44,15.11 15.29,15.27 15.37,22.86 38.99,22.86 38.99,17.53 23.62,17.53 22.73,16.64 22.73,14.22 24,12.95 26.54,10.67 26.54,6.22 25.78,5.46 23.11,5.46 21.72,6.99 19.94,6.99 19.3,6.22 19.3,4.57 16.89,2.16
+12V  (via drill 0.4 pad 0.65)
  Top 0.406: v11.35,16.41 12.01,15.75 D3.3 | C33.P$1 14.62,21.25 v13.87,20.5 13.08,21.29 D1.3 | v12.34,7.06 12.29,7.01 D4.3 13.2,6.97 C32.P$1
  Bottom 0.152: PAD3.1 3.15,21.11 v4.04,21.11
  Bottom 0.406: IC2.1 12.75,17.96 12.27,18.44 C14.+ 13.08,19.71 | 16.57,21.25 IC11.1 | 12.61,21.25 C35.+ 12.78,21.59 | IC10.1 12.39,7.11 v12.34,7.06 | IC9.1 15.29,12.57 v15.54,12.83 15.54,12.18 C27.P$1
  Bottom 0.61: 16.57,21.25 C33.P$1 12.61,21.25 | 13.08,19.71 v13.87,20.5 | v13.87,20.5 12.78,21.59 | 12.27,20.64 13.72,20.64 v13.87,20.5
  Bottom 0.813: C14.+ 12.27,20.64 C35.+
  other vias: 4.04,21.95 4.04,20.27
  pour Route15 (isolate 0.254): 0,22.86 14.66,22.86 14.58,15.04 15.37,14.33 15.85,13.94 16.23,13.56 16.26,11.94 15.49,11.18 13.46,11.18 12.83,10.54 12.83,6.99 12.06,6.22 6.48,6.22 3.81,8.64 0,8.64
  pour Bottom: 11.94,22.35 11.94,19.05 12.7,19.05 13.97,20.32 13.97,21.59 13.21,22.35
A
  Top 0.152: IC3.40 31.06,7.74 31.5,8.18 31.5,10.49 32.87,11.86 32.87,15.72 33.5,16.36 34.42,16.36 X1.2
B
  Top 0.152: IC3.41 30.8,8.24 31.11,8.56 31.11,10.67 32.49,12.04 32.49,16.61 33.48,17.6 34.42,17.6 X1.3
BUSS+  (via drill 0.4 pad 0.65)
  Top 0.406: v12.55,17.02 13.24,16.32 R12.P$2
  Bottom 0.152: 3.28,17.75 4.37,17.75 5.44,18.82 8,18.82 8.18,18.64 10.92,18.64 v12.55,17.02
  Bottom 0.406: X4.4 X4.2 1.32,15.13 2.49,16.31 v3.28,16.31 3.28,17.75 X4.MF1
CAN_+5V
  Top 0.152: IC8.8 10.62,1.88 9.88,2.62 9.88,3.07 9.07,3.89 9.07,4.04 8.55,4.56 C13.P$2 LED5.A 6.69,4.55 6.4,4.27 6.08,3.94 X3.4
CAN_GND  (via drill 0.4 pad 0.65)
  Top 0.406: X3.1 6.99,7.69 v7.09,7.8 | R11.P$1 8.36,1.84 8.5,1.97 v9.17,2.34 9.08,2.34 9.08,2.55 8.56,3.07 C13.P$1 | 10.82,5.69 IC8.5 v12.52,5.69
  pour Route2 (isolate 0.254): 13.08,5.33 9.65,1.91 8.51,1.91 6.22,4.19 6.22,7.75 6.73,8.26 7.75,8.26 9.27,6.73 12.57,6.73 13.08,6.22
CAN_H
  Top 0.152: IC8.7 10.52,3.17 9.47,4.22 9.47,5.46 8.89,6.04 R20.P$1 8.46,6.03 8.46,5.36 8.29,5.19 X3.3
CAN_L
  Top 0.152: IC8.6 10.49,4.42 9.86,5.05 9.86,5.82 8.89,6.78 7.54,6.78 6.96,6.2 R20.P$2 6.5,6.04 6.12,6.43 4.88,6.43 X3.2
CAN_RX
  Top 0.152: IC8.2 18.31,3.15 19.79,1.68 26.06,1.68 26.75,2.36 26.75,3.43 26.39,3.79 26.39,4.73 IC3.32
CAN_TX
  Top 0.152: IC8.3 15.67,4.42 15.47,4.22 15.47,2.74 15.7,2.52 18.44,2.52 19.58,1.37 26.21,1.37 27.05,2.21 27.05,3.66 26.92,3.79 26.92,4.72 IC3.33
CURRENT  (via drill 0.4 pad 0.65)
  Top 0.152: IC3.14 21.78,11.24 22.25,11.25 23.06,10.44 v23.06,10.01
  Bottom 0.152: R31.P$1 22.47,10.62 v23.06,10.01 23.07,9.38 IC4.1
GND  (via drill 0.4 pad 0.65)
  Top 0.152: IC3.8 24.92,13.23
  Top 0.305: U2.12 24.98,20.18 v24.84,20.04 | IC3.35 27.9,3.95 28.27,3.58 v28.96,3.58 | IC3.47 28.84,11.24 v28.42,10.82 28.69,10.55 28.69,10.08 29.03,9.74 IC3.44 | R19.P$1 6.4,19.96 5.34,18.91 X2.1
  Top 0.61: v37.44,3.99 JTAG.7
  Bottom 0.152: 18.29,14.78 19.15,14.78 IC11.4 | C2.P$2 24.23,7.85 | R28.P$1 25.9,6.44 | IC1.2 26.87,7.21
  Bottom 0.305: v24.84,20.04 23.71,20.04 C34.P$2 | v28.96,3.58 30.26,3.58 C4.P$2 | C1.P$2 27.37,10.82 v28.42,10.82 28.69,10.55 C3.P$2
  Bottom 0.406: X4.12 X4.14 v1.32,7.6 v1.32,7.59 | v2.29,6.27 2.29,5.33 2.52,5.11 2.54,5.11 2.56,5.08 X4.MF2 | v15.62,8.61 15.62,8.53 | IC2.4 12.75,14.15 v12.57,14.33 | C22.P$1 20.54,2.02 | C9.P$2 C12.P$1 | 17.98,12.65 18.29,12.34 18.75,12.34
  Bottom 0.61: v8.03,21.41 9.53,21.41 C14.- 9.55,19.68 8.15,19.68 | IC11.4 19.2,16.31
  other vias: 4.11,1.75 4.11,2.59 4.11,0.91 12.75,3.3 34.44,14.17 17.22,16.31 15.39,18.82 17.37,12.73 15.7,6.55 21.11,2.74 30.78,13.26 24.92,12.09 23.95,8.81 26.52,7.01 6.45,22.12 11.96,8.94 0.89,16.33 33.38,3.3
  pour Top (isolate 0.203, rank 6): 0,0 0,22.86 39.01,22.89 39.24,0
  pour Bottom (isolate 0.254, rank 6): 0,0 0,22.86 38.99,22.86 39.24,0
  pour Route2 (isolate 0.254, rank 2): 0,0 0,22.86 39.24,22.86 39.24,0
LEDA
  Top 0.152: R1.P$1 9.68,13.72 10.36,13.03 10.36,12.27 11.12,11.51 14.81,11.51 15.54,10.77 18.49,10.77 18.9,10.36 19.38,10.36 19.46,10.29 19.51,10.29 21.36,10.29 IC3.16
LEDB
  Top 0.152: R3.P$1 9.39,10.9 13.41,10.9 14.28,10.01 18.09,10.01 18.44,9.65 19.23,9.65 19.64,9.24 IC3.18
LEDG
  Top 0.152: R2.P$1 9.63,12.19 10.15,11.67 10.63,11.2 14.15,11.2 14.99,10.36 18.29,10.36 18.64,10.01 19.33,10.01 19.59,9.74 IC3.17
LEDR
  Top 0.152: R4.P$1 10.52,9.14 10.96,9.6 17.83,9.6 18.21,9.22 18.21,8.69 18.52,8.38 19.81,8.38 20.17,8.74 IC3.19
N$1
  Top 0.152: LED5.C R11.P$2
N$2  (via drill 0.4 pad 0.65)
  Top 0.406: v10.52,18.01 11.15,18.64 D1.1
  Bottom 0.152: C23.+ 6.94,17.96 IC2.8
  Bottom 0.406: IC2.8 9.12,18.01 v10.52,18.01
N$3
  Top 0.152: LED1.C R1.P$2
N$4
  Top 0.152: LED4.C R4.P$2
N$5
  Top 0.152: LED3.C R3.P$2
N$6
  Top 0.152: R21.P$2 6.41,18.3 6.4,18.29 5.77,17.67 X2.2
N$7  (via drill 0.4 pad 0.65)
  Top 0.152: D3.1 11.18,13.61 v11.18,12.68 11.7,12.15 C24.+
  Bottom 0.152: IC9.8 9.17,12.68 v11.18,12.68
N$8  (via drill 0.4 pad 0.65)
  Top 0.152: D4.1 10.34,7.19 v10.34,7.11
  Bottom 0.152: C25.+ 6.97,6.88 | C25.+ 7.04,6.94 | IC10.8 8.03,7.1 7.62,6.68 7.54,6.68 C25.+
  Bottom 0.305: IC10.8 v10.34,7.11
N$10
  Top 0.152: LED2.C R2.P$2
N$11  (via drill 0.4 pad 0.65)
  Top 0.152: v23.88,10.67 24.69,9.86 24.69,7.95 v23.09,6.33 21.72,4.95 20.95,4.95 20.34,4.34 20.34,3.12 v20.12,2.9
  Bottom 0.152: R27.P$1 16.69,1.75 17.83,2.9 v20.12,2.9 | IC4.3 22.79,6.62 v23.09,6.33 23.27,6.15 R28.P$2 | R29.P$2 24.36,9.84 24.36,9.98 23.88,10.5 v23.88,10.67
N$12
  Bottom 0.152: IC4.4 20.18,7.84 21.13,8.79 21.13,9.83 20.98,9.98 R31.P$2 20.97,11.29 21.89,12.22 R30.P$2
N$20
  Top 0.152: R24.P$2 6.41,16.9 6.4,16.89 5.92,16.39 X2.3
N$22
  Bottom 0.305: IC1.4 30.23,8.78 30.2,8.81 30.2,9.56 C3.P$1
N$33
  Top 0.152: R8.P$1 21.25,3.66 23.09,3.66 23.4,3.97 IC3.26
N$36
  Top 0.152: IC3.27 R9.P$1
N$39  (via drill 0.4 pad 0.65)
  Top 0.152: IC3.28 24.4,3.64 24.77,3.28 v24.77,2.29
  Bottom 0.152: v24.77,2.29 24.23,1.75 23.51,1.75 R10.P$1
N$40
  Top 0.152: IC3.5 26.4,13.95 27.52,15.07 Q1.3
N$41  (via drill 0.4 pad 0.65)
  Top 0.152: 24.89,4.75 IC3.29 24.9,5.65 25.12,5.87 v25.12,10.57 | R5.P$2 14.88,12.24 15.16,11.96 17.68,11.96 17.83,12.12 v20.19,12.12
  Bottom 0.152: v25.12,10.57 24.36,11.33 23.62,11.33 23.34,11.61 23.34,12.57 23.01,12.9 21.64,12.9 20.85,12.12 v20.19,12.12
N$42  (via drill 0.4 pad 0.65)
  Top 0.152: IC3.30 25.4,2.69 v25.78,2.31
  Bottom 0.152: R6.P$2 18.81,5.65 19.89,4.57 19.91,4.55 20.09,4.37 22.43,4.37 22.63,4.57 23.65,4.57 23.93,4.29 23.93,3.15 24.13,2.95 25.15,2.95 v25.78,2.31
N$45  (via drill 0.4 pad 0.65)
  Top 0.152: IC3.31 25.9,3.33 v26.04,3.2
  Bottom 0.152: R7.P$2 25.41,3.8 v26.04,3.2
PHASE_U  (via drill 0.4 pad 0.65)
  Top 0.152: R14.P$1 27.14,21.48 26.57,22.05 7.64,22.05 6.91,21.31 5.59,21.31 4.8,20.52 4.8,19.96 4.42,19.58 3.81,19.58 2.46,18.24 2.46,15.72 v3.28,14.91
  Bottom 0.152: IC2.6 7.92,15.42 7.1,16.25 C23.- 6.76,14.25 6.44,13.93 X4.3 5.22,13.95 3.99,13.95 3.28,14.66 v3.28,14.91
PHASE_V  (via drill 0.4 pad 0.65)
  Top 0.152: R16.P$1 18.68,14.86 16.79,14.86 16.1,15.54 13.87,15.54 13.26,14.94 13.26,13.79 12.52,13.06 v12.52,13.03 | C24.- 10.61,10.25 v10.59,10.24
  Bottom 0.152: v12.52,13.03 12.52,12.17 v10.59,10.24 10.39,10.03 IC9.6 7.87,10.03 6.98,10.93 X4.9
PHASE_W
  Bottom 0.152: X4.8 2.69,11.43 3.58,10.54 3.58,7.64 5.33,5.89 5.33,4.04 5.71,3.66 6.76,3.66 8.71,1.7 9.68,1.7 10.46,2.49 10.46,4.24 10.13,4.57 | C25.- 6.77,4.78 7.67,4.78 7.87,4.57 IC10.6 10.13,4.57 | 16.65,6.36 R18.P$1 16.65,6.44 15.24,7.85 12.06,7.85 11.58,7.37 11.58,5.99 10.13,4.57
RST  (via drill 0.4 pad 0.65)
  Top 0.152: C6.P$2 25.83,14.4 25.4,13.97 IC3.7 25.4,12.44 26.09,11.76 v27.76,11.76 | JTAG.2 31.47,4.95 v31.45,4.98
  Bottom 0.152: v27.76,11.76 29.57,11.76 31.45,9.88 v31.45,4.98
RXD
  Top 0.152: IC3.43 26.8,9.24 26.57,9.47 26.57,10.62 25.7,11.48 24.56,11.48 24.03,12.01 22.89,12.01 22.4,12.5 22.4,15.16 22.02,15.54 20.88,15.54 19.56,16.87 18.29,16.87 17.93,17.22 15.47,17.22 14.48,18.21 11.73,18.21 10.9,17.37 9.98,17.37 8.84,18.52 R21.P$1 R19.P$2
SHUNT
  Bottom 0.152: X4.10 2.47,10.43 2.87,10.03 2.87,8.05 1.09,6.27 1.09,4.24 1.5,3.83 4.93,3.83 5.44,3.33 6.45,3.33 8.59,1.19 10.11,1.19 10.67,1.75 R27.P$2
STAR_VOLTAGE  (via drill 0.4 pad 0.65)
  Top 0.152: U2.8 25.35,17.58 25.35,17.6 v24.87,18.09 24.87,18.64 25.11,18.88 U2.10 28.12,18.88 29.18,19.96 29.32,19.96 R23.P$2 | v21.77,18.24 U2.6 19.55,18.23 19.07,18.69 19.07,18.9 18.72,19.25 R26.P$2 | v21.77,18.24 21.79,18.24 | R25.P$2 21.77,16.52 v21.77,18.24
  Bottom 0.152: v24.87,18.09 21.92,18.09 v21.77,18.24
TCK
  Top 0.152: JTAG.8 34.44,8.76 35.2,8 35.2,4.5 34.82,4.12 31.32,4.12 30.86,4.57 30.86,5.94 30.56,6.24 IC3.37
TDI
  Top 0.152: JTAG.4 31.75,6.22 31.55,6.22 31.03,6.74 IC3.38
TDO
  Top 0.152: JTAG.6 33.13,7.24 IC3.39
TEMP  (via drill 0.4 pad 0.65)
  Top 0.152: IC3.15 20.32,10.74 20.12,10.95 v19.63,10.95 19.11,11.47 R32.P$2
  Bottom 0.152: TH1.P$1 18.81,10.9 18.97,10.9 19.02,10.95 v19.63,10.95
TMS
  Top 0.152: IC3.34 27.4,3.86 28.83,2.44 33.73,2.44 35.64,4.34 35.64,9.35 34.95,10.03 JTAG.10
TXD
  Top 0.152: R24.P$1 11.07,16.99 11.86,17.78 14.22,17.78 15.09,16.92 17.6,16.92 18.09,16.43 18.97,16.43 19.51,15.9 19.51,14.25 19.74,14.02 20.83,14.02 21.92,12.93 21.92,12.45 22.73,11.63 23.88,11.63 24.36,11.15 25.5,11.15 26.16,10.49 26.16,9.35 26.77,8.74 IC3.42
U_COMM
  Top 0.152: U2.13 24.71,20.83 23.9,20.02 IC3.10
U_GATE_HIGH
  Bottom 0.152: X4.1 5.24,16.54 5.89,17.2 7.57,17.2 8.08,16.69 IC2.7
U_GATE_LOW
  Bottom 0.152: X4.5 6.4,12.93 7.62,14.15 IC2.5
U_HIGH  (via drill 0.4 pad 0.65)
  Top 0.152: R5.P$1 15.89,13.76 v16.15,14.02
  Bottom 0.152: IC2.2 15.24,16.69 16.15,15.77 v16.15,14.02
U_LOW  (via drill 0.4 pad 0.65)
  Top 0.152: v17.53,8.99 17.53,8.15 19.36,6.33 19.36,4.05 R8.P$2
  Bottom 0.152: IC2.3 15.21,15.42 15.42,15.21 15.42,13.92 16.69,12.65 16.69,9.83 v17.53,8.99
U_VOLTAGE
  Top 0.152: C36.P$1 R15.P$1 R23.P$1 29.31,21.48 29.21,21.46 28.57,20.83 28.57,20.6 27.96,19.99 R14.P$2 27.67,19.98 27.61,19.91 27.22,19.53 U2.11
USART_+5V
  Top 0.406: D2.A 5.86,15.47 5.85,15.47 5.51,15.14 X2.4
V_BATT
  Top 0.152: R12.P$1 16.24,14.83 17.12,13.96 R13.P$2 19.19,13.96 19.51,13.64 20.68,13.64 21.4,12.91 IC3.13
V_COMM
  Top 0.152: U2.14 24.69,21.49 23.4,20.2 IC3.11
V_GATE_HIGH
  Bottom 0.152: X4.7 7.09,11.93 7.72,11.3 IC9.7
V_GATE_LOW
  Bottom 0.152: X4.11 6.88,9.93 8.05,8.76 IC9.5
V_HIGH
  Bottom 0.152: 17.3,7.89 R6.P$1 17.3,8.05 16.83,8.52 16.82,8.55 16.82,9.02 15.93,9.91 15.93,10.13 14.76,11.3 IC9.2
V_LOW  (via drill 0.4 pad 0.65)
  Top 0.152: R9.P$2 22,2.56 21.41,1.98 20.02,1.98 18.34,3.66 v18.34,4.7
  Bottom 0.152: v18.34,4.7 17.37,5.66 17.37,6.81 17.12,7.06 16.87,7.06 16.36,7.57 16.36,8.81 15.14,10.03 IC9.3
V_VOLTAGE  (via drill 0.4 pad 0.65)
  Top 0.152: R16.P$2 21.5,14.83 R25.P$1 21.72,14.61 v21.72,14.07 | U2.9 27.21,18.23 v27.3,18.14
  Bottom 0.152: C37.P$1 R17.P$1 27.32,18.15 v27.3,18.14 25.88,18.14 21.79,14.07 v21.72,14.07
W_COMM
  Top 0.152: U2.1 22.25,21.49 22.9,20.84 IC3.12
W_GATE_HIGH
  Bottom 0.152: X4.13 7.07,8.93 8.1,7.9 10.62,7.9 11.05,7.49 11.05,6.6 10.29,5.84 IC10.7
W_GATE_LOW
  Bottom 0.152: X4.15 5.24,6.62 5.79,6.07 5.79,4.17 5.94,4.01 7.06,4.01 7.77,3.3 IC10.5
W_HIGH
  Bottom 0.152: R7.P$1 22.61,3.81 22.45,3.96 17.96,3.96 16.66,5.26 15.75,5.26 15.16,5.84 IC10.2
W_LOW
  Bottom 0.152: IC10.3 16.51,4.57 17.58,3.5 21.51,3.5 21.96,3.06 R10.P$2
W_VOLTAGE  (via drill 0.4 pad 0.65)
  Top 0.152: v21.18,17.4 21.01,17.58 U2.7 18.7,17.58 R26.P$1 C38.P$1 16.98,17.75 16.9,17.83 v16,17.83
  Bottom 0.152: v16,17.83 16,16.54 16.92,15.62 16.92,13.72 17.3,13.34 19.05,13.34 19.53,12.85 19.53,11.81 19.86,11.51 20.02,11.51 20.24,11.25 20.24,10.49 19.81,10.06 19.13,10.06 18.21,9.14 18.21,6.31 R18.P$2 | R22.P$1 23.63,17.4 v21.18,17.4

### Text on the board
Top: OPEN-BLDC | (C) JOBY ROBOTICS | CC-BY-SA CLOGIC V0.1
tPlace: UART | GND | 5V | B | RX | A | TX | GND | 5V | ENC | GND | L | H | 5V | JTAG | CAN
bNames: Open-BLDC.org | (C) 2010 esden | CC-BY-SA 3.0 | OBLDC V0.4 | CAN | I2C | JTAG
tStop: OPEN-BLDC | (C) JOBY ROBOTICS | CC-BY-SA CLOGIC V0.1